# Altium schematic sheet Cascade.SchDoc
size A; SheetNumber: 8; SheetTotal: 9
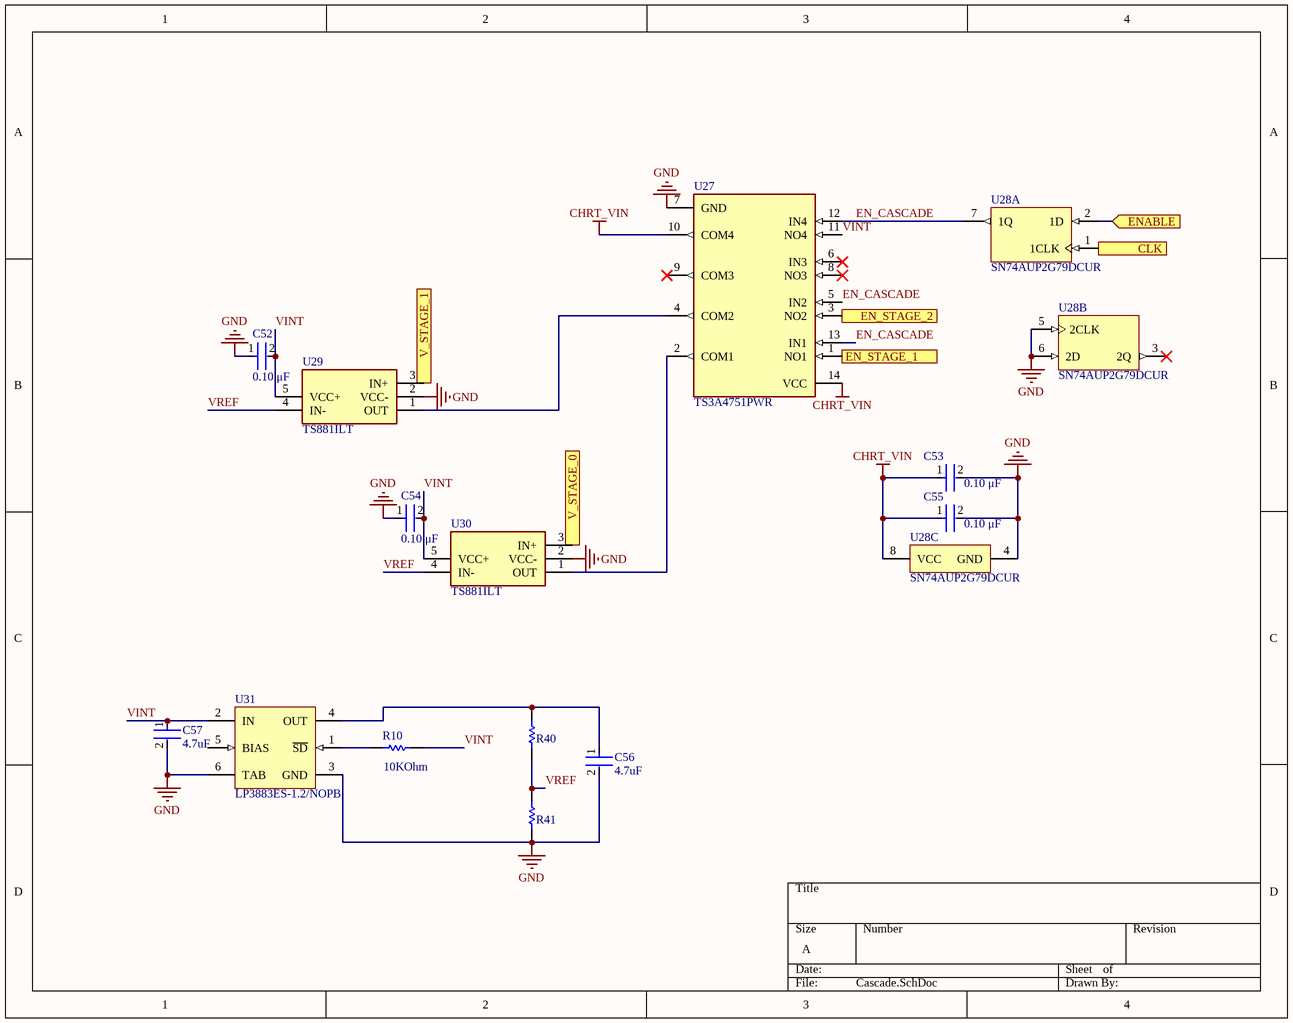
[diagram p0: Cascade.SchDoc]

## Parts
C52  Capacitance: 0.10 μF  [FP-C0402-BB-MFG]  (hidden comment: C0402C104K8PACTU)
C53  Capacitance: 0.10 μF  [FP-C0402-BB-MFG]  (hidden comment: C0402C104K8PACTU)
C54  Capacitance: 0.10 μF  [FP-C0402-BB-MFG]  (hidden comment: C0402C104K8PACTU)
C55  Capacitance: 0.10 μF  [FP-C0402-BB-MFG]  (hidden comment: C0402C104K8PACTU)
C56  Capacitance: 4.7uF  [FP-GRM155-0_1-IPC_B]  (hidden comment: GRM155R60J475ME47D)
C57  Capacitance: 4.7uF  [FP-GRM155-0_1-IPC_B]  (hidden comment: GRM155R60J475ME47D)
R10  Resistance: 10KOhm  [RESC1005X40X25LL05T05]  (hidden comment: ERJ2RKF1002X)
R40  ERJ-2GEJ915X  [RESC1005X40X25LL05T05]  (value not drawn)
R41  CRCW04022M40FKED  [RESC1005X40X25LL05T05]  (value not drawn)
U27  TS3A4751PWR  [FP-PW0014A-IPC_C]
U28  SN74AUP2G79DCUR  [DCU0008A_L]  (parts A,B,C of 3)
U29  TS881ILT  [SOT95P280X145-5N]
U30  TS881ILT  [SOT95P280X145-5N]
U31  LP3883ES-1.2/NOPB  [KTT0005B_M]

## Ports
CLK (in), EN_STAGE_1 (in), EN_STAGE_2 (in), ENABLE (in), V_STAGE_0 (in), V_STAGE_1 (in)

## Nets
CHRT_VIN: C53.1 C55.1 U27.10(COM4) U27.14(VCC) U28.8(VCC)
GND: C52.1 C53.2 C54.1 C55.2 C56.2 C57.2 R41.2 U27.7(GND) U28.4(GND) U28.5(2CLK) U28.6(2D) U29.2(VCC-) U30.2(VCC-) U31.3(GND) U31.6(TAB)
CLK: U28.1(1CLK) ; port CLK
EN_CASCADE: U27.5(IN2) U27.12(IN4) U27.13(IN1) U28.7(1Q)
EN_STAGE_1: U27.1(NO1) ; port EN_STAGE_1
EN_STAGE_2: U27.3(NO2) ; port EN_STAGE_2
ENABLE: U28.2(1D) ; port ENABLE
V_STAGE_0: U30.3(IN+) ; port V_STAGE_0
V_STAGE_1: U29.3(IN+) ; port V_STAGE_1
VINT: C52.2 C54.2 C57.1 R10.2 U27.11(NO4) U29.5(VCC+) U30.5(VCC+) U31.2(IN)
VREF: R40.1 R41.1 U29.4(IN-) U30.4(IN-)
NetC56_1: C56.1 R40.2 U31.4(OUT)
NetR10_1: R10.1 U31.1(~{SD})
NetU27_2: U27.2(COM1) U30.1(OUT)
NetU27_4: U27.4(COM2) U29.1(OUT)

Not connected (* = marked no-connect by the designer): U27 6(IN3)* 8(NO3)* 9(COM3)*; U28 3(2Q)*; U31 5(BIAS)

## Library data of the parts
C52-C55 = CMP-2008-02046-2: CAP CER 0.1UF 10V X5R 0402; Manufacturer: Kemet; Material: Ceramic; Temperature Coefficient: 15%; Tolerance: 0.1; Value: 0.10 μF; Package: C0402-BB; Temperature: -55°C to +125°C; ComponentLink2Description: Datasheet; Temperature Characteristic: X5R; Device Class L1: Passive Components; Height: 0.55mm; Lead Free: Yes; ComponentLink2URL: https://content.kemet.com/datasheets/KEM_C1002_X7R_SMD.pdf; Device Class L2: Capacitors; Temperature Range Low: -55°C; Temperature Range High: +125°C; RoHS: TRUE; Octopart: https://octopart.com/c0402c104k8pactu-kemet-140039; Automotive: No; Mouser Description: Capacitor 100 nF 10 VDC 0402; Category: Cap; Voltage Rating: 10 V; Digikey Description: CAP CER 0.1UF 10V X5R 0402; Ipc Land Pattern Name: CAPC10050X50; Device Class L3: Ceramic Capacitors; Manufacturer Part Number: C0402C104K8PACTU
C56 C57 = CMP-2008-04549-2: Chip Multilayer Ceramic Capacitors for General Purpose, 0402, 4.7uF, X5R, 15%, 20%, 6.3V; Height: 0.5mm; Weight: 0.000212oz; Length: 1mm; Case Code (Metric): 1005; Packaging: Tape and Reel; Termination: SMD/SMT; Dielectric: X5R; Depth: 0.5mm; Case Code (Imperial): 0402; Min Operating Temperature: -55°C; Case/Package: 0402; Voltage: 6.3V; Width: 0.02inch; Lead Free: Lead Free; Thickness: 0.022inch; Contact Plating: Tin; REACH SVHC: No SVHC; Package Quantity: 10000; Tolerance: 20%; Voltage Rating (DC): 6.3V; Voltage Rating: 6.3V; Mount: Surface Mount; Max Operating Temperature: 85°C
R10 = CMP-2000-07588-1: Chip Resistor, 10 KOhm, +/- 1%, 0.1 W, -55 to 155 degC, 0402 (1005 Metric), RoHS, Tape and Reel; Manufacturer: Panasonic; Power Rating: 100mW; Voltage Rating: 50V; Case\/Package: 0402; Temperature Coefficient: 100ppm\/degreesC; RoHSCompliant: True; Lead Free: LeadFree; Package Quantity: 1; Contact Plating: Tin; Length: 1mm; Radiation Hardening: No; REACH SVHC: NoSVHC; Max Operating Temperature: 155degC; Depth: 0.5mm; Case Code (Imperial): 0402; Military Standard: Not; Package Description: 2-Pin Surface Mount Device, Body 1 x 0.5 mm; Termination: SMD/SMT; Case Code (Metric): 1005; Height: 0.35mm; Packaging: TapeandReel; Voltage Rating (DC): 50V; Package Reference: 402; Number of Pins: 2; Tolerance: 1%; Mounting Technology: SurfaceMount; Width: 0.02inch; Mount: SurfaceMount; Datasheet URL: https://industrial.panasonic.com/cdbs/www-data/pdf/RDA0000/AOA0000C304.pdf; Composition: ThickFilm; Datasheet Version: 02/2017; Manufacturer URL: http://www.panasonic.com/; Max Power Dissipation: 100mW; Number of Terminations: 2; Min Operating Temperature: -55degC
R40 = CMP-2002-00597-1: Manufacturer: Panasonic; Part Number: ERJ-2GEJ915X
R41 = CMP-1011-00890-2: Manufacturer: Vishay Dale; Part Number: CRCW04022M40FKED
U27 = CMP-04892-000059-1: IC SWITCH QUAD SPST 14TSSOP; Bandwidth: 125MHz; High Level Output Current: 100mA; Max Supply Voltage: 3.6V; Operating Supply Voltage: 3V; Polarity: Non-Inverting; Turn-Off Delay Time: 9ns; On-State Resistance: 900mR; Supply Type: Single; Max Supply Current: 75nA; Number of Inputs: 4; Turn-On Delay Time: 14ns; Min Supply Voltage: 1.6V; Packaging: Tape and Reel; Contact Plating: Gold; Mount: Surface Mount; Low Level Output Current: 100mA; Termination: SMD/SMT; Min Operating Temperature: -40°C; Case/Package: TSSOP; REACH SVHC: No SVHC; Weight: 0.002018oz; Number of Pins: 14; Throw Configuration: SPST; Height: 1.05mm; Radiation Hardening: No; Length: 5.1mm; Max Operating Temperature: 85°C; Package Quantity: 1; Lead Free: Lead Free; RoHS Compliant: Yes; Number of Channels: 4; Number of Outputs: 4; Width: 4.5mm
U28 = CMP-0859-00716-3: Low-Power Dual Positive-Edge-Triggered D-Type Flip-Flop, DCU0008A, LARGE T&R; Manufacturer: Texas Instruments; ICC @ Nom Voltage(Max)(mA): 0.0009; 3-State Output: No; Input Type: CMOS; Rating: Catalog; Output Drive (IOL/IOH)(Max)(mA): 20/-20; VCC(Max)(V): 3.6; Bits(#): 2; Technology Family: AUP; Logic: True; Voltage(Nom)(V): 0.8,1.2,1.5,1.8,2.5,3.3; VCC(Min)(V): 0.8; tpd @ Nom Voltage(Max)(ns): 27.2,17.3,13.3,11.3,7.8,6.3; F @ Nom Voltage(Max)(Mhz): 100; DatasheetVersion: SCES755C; Generic Part Number: SN74AUP2G79; Sub-Family: D-Type Flip-Flop; PackageReference: DCU0008A; Schmitt Trigger: No; Output Type: CMOS; Operating Temperature Range(C): -40 to 85
U29 U30 = TS881ILT: Integrated Circuit; Manufacturer_Name: STMicroelectronics; Datasheet Link: http://www.st.com/resource/en/datasheet/DM00057901.pdf; Height: 1.45mm; Manufacturer_Part_Number: TS881ILT
U31 = CMP-0062-00468-3: 3A Fast-Response Ultra Low Dropout Linear Regulators, 5-pin TO-263, Pb-Free; Manufacturer: Texas Instruments; CompType: LDO IC; PowerWise: N; PackageTopMarking: NSUZXYTTE#*LP3883ES*-1.2; PackageDescription: TO-263, Molded, .400 x .390 x .180in, 5 Lead, .067in Pitch, Surface Mount; Code_JEDEC: MO-169-AB; PinCount: 5; ComponentLink1Description: Datasheet URL; PackageReference: KTT0005B; RoHS: Y; ComponentLink1URL: http://www.ti.com/general/docs/lit/getliterature.tsp?genericPartNumber=LP3883&fileType=pdf